# EAGLE schematic brick_i2c_humidity_Si7034 (EAGLE 7.4.0)
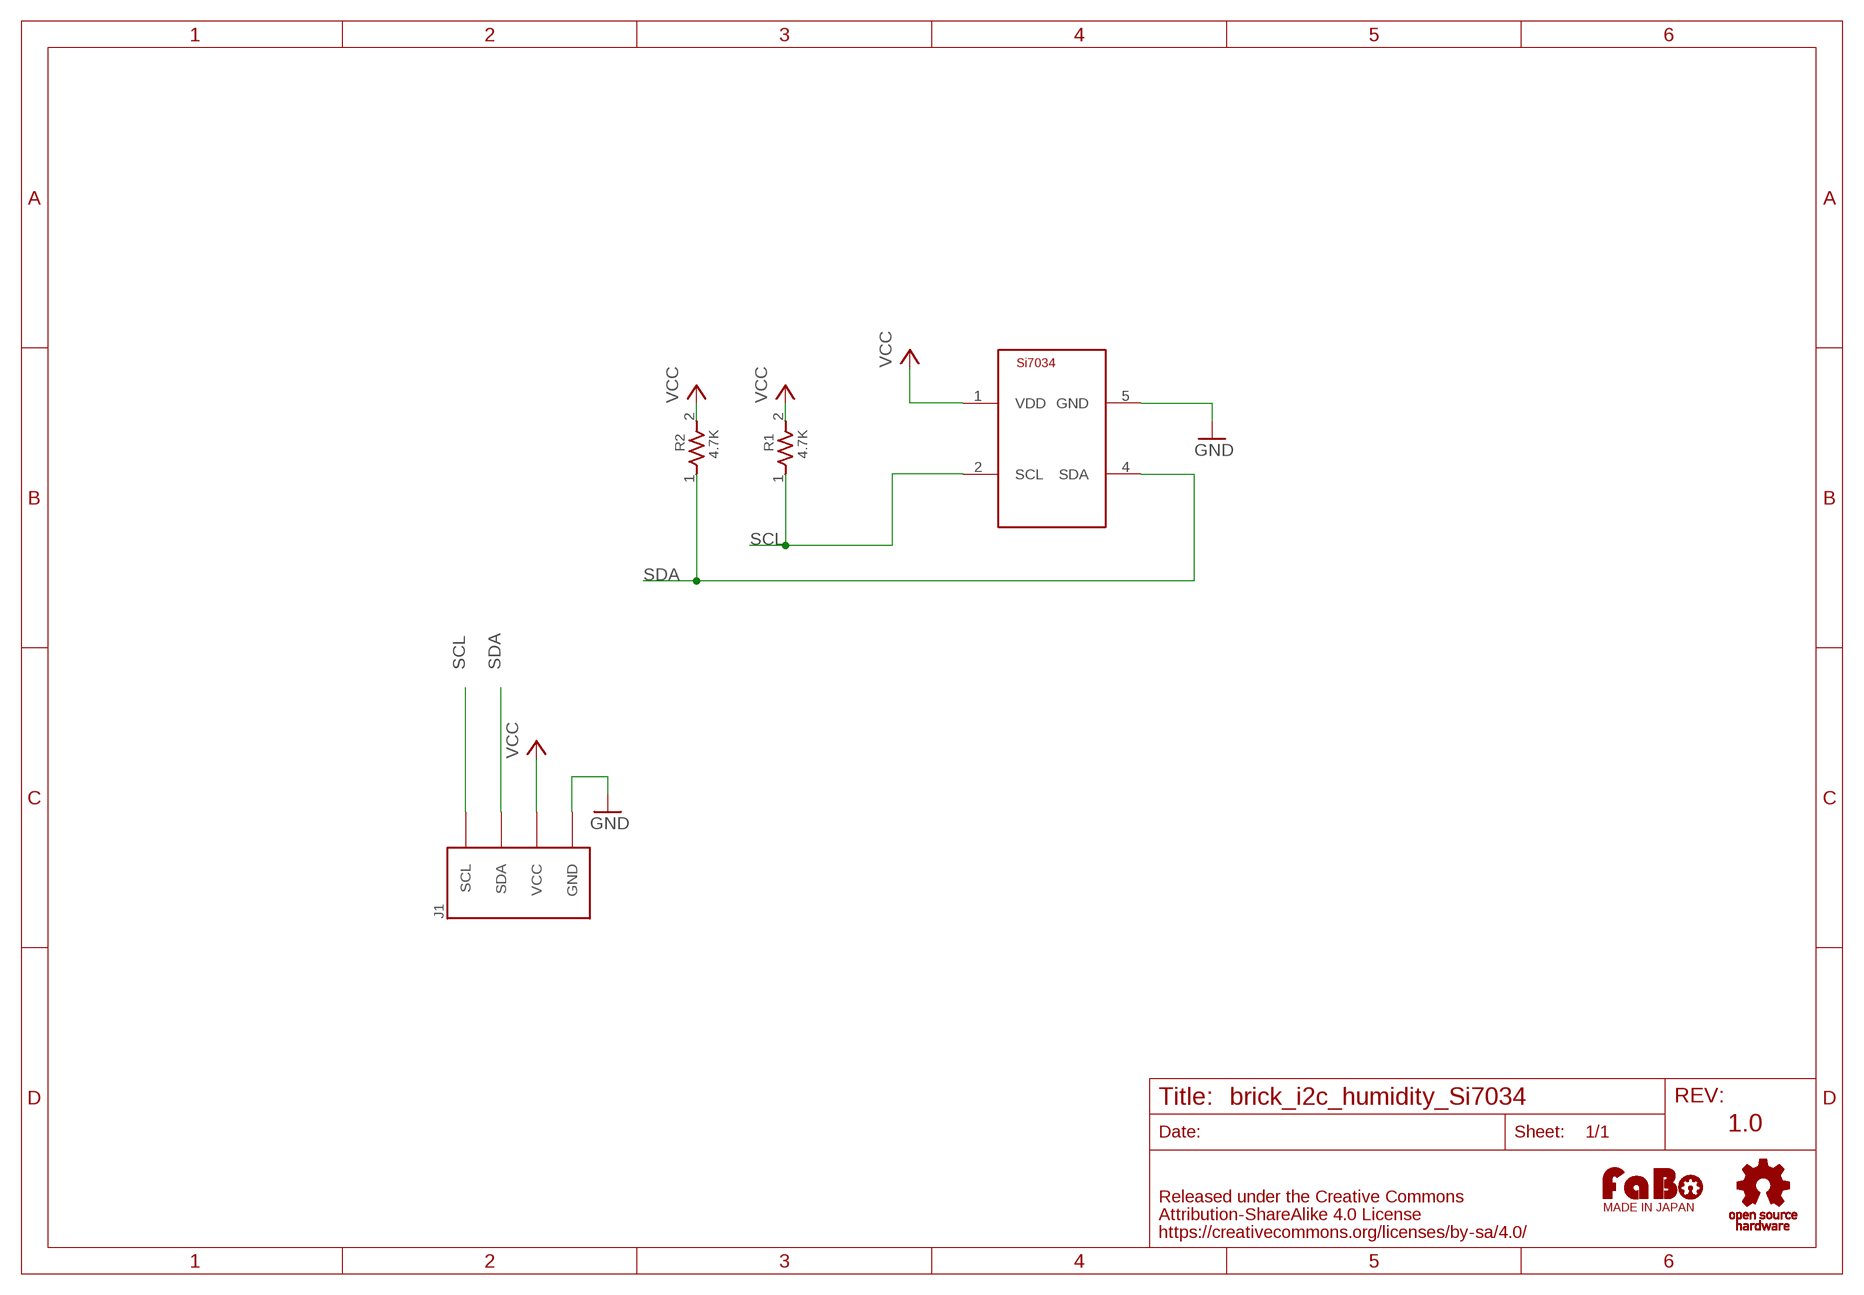
[diagram p0: schematic, sheet 1]

## Parts
J1  BRICK_I2C  [BRICK_I2C]
R1  4.7K  RESISTOR0603  [0603]
R2  4.7K  RESISTOR0603  [0603]
U$2  LOGO_FABO-M  [LOGO_FABO_M]
U$3  SILICONLABS-SI7034  [SILICONLABS-SI7034]
U$4  LOGO_OSHW_T-M  [LOGO_OSHW_T_M]

## Nets
GND: J1.GND U$3.5(GND)
SCL: J1.SCL R1.1 U$3.2(SCL)
SDA: J1.SDA R2.1 U$3.4(SDA)
VCC: J1.VCC R1.2 R2.2 U$3.1(VDD)

## Notes on the sheet
- 1.0

## Library data of the parts
J1 = gclue:BRICK_I2C: FaBo Brick 4pin(I2C)
R1 R2 = GClue-Resistors:RESISTOR
U$2 = FaBo:LOGO_FABO
U$3 = FaBo-Mems:SILICONLABS-SI7034
U$4 = gclue:LOGO_OSHW_T